# EAGLE design controller-left (EAGLE 8.6.0)
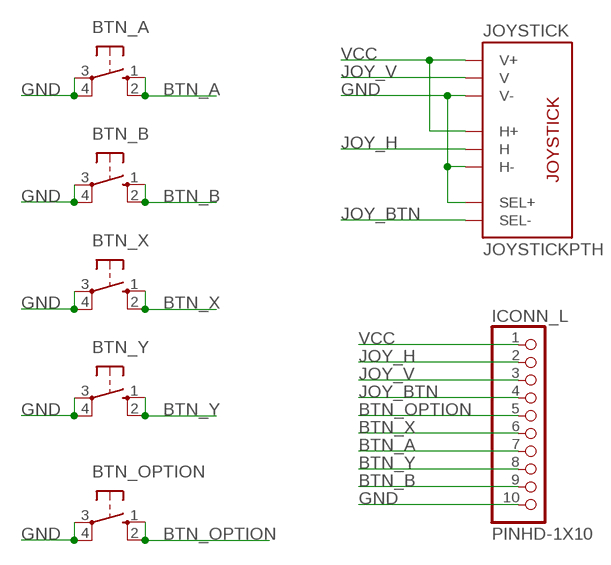
[diagram p0: schematic, sheet 1]

## Parts
BTN_A  40-XX-ROUND  [B3F-40XX-ROUND]
BTN_B  40-XX-ROUND  [B3F-40XX-ROUND]
BTN_OPTION  40-XX-ROUND  [B3F-40XX-ROUND]
BTN_X  40-XX-ROUND  [B3F-40XX-ROUND]
BTN_Y  40-XX-ROUND  [B3F-40XX-ROUND]
ICONN_L  PINHD-1X10  [1X10-BIG]
JOYSTICK  JOYSTICKPTH  [JOYSTICK]

## Nets
BTN_A: BTN_A.1(S) BTN_A.2(S1) ICONN_L.7
BTN_B: BTN_B.1(S) BTN_B.2(S1) ICONN_L.9
BTN_OPTION: BTN_OPTION.1(S) BTN_OPTION.2(S1) ICONN_L.5
BTN_X: BTN_X.1(S) BTN_X.2(S1) ICONN_L.6
BTN_Y: BTN_Y.1(S) BTN_Y.2(S1) ICONN_L.8
GND: BTN_A.3(P) BTN_A.4(P1) BTN_B.3(P) BTN_B.4(P1) BTN_OPTION.3(P) BTN_OPTION.4(P1) BTN_X.3(P) BTN_X.4(P1) BTN_Y.3(P) BTN_Y.4(P1) ICONN_L.10 JOYSTICK.B1A(SEL+) JOYSTICK.H3(H-) JOYSTICK.V3(V-)
JOY_BTN: ICONN_L.4 JOYSTICK.B2A(SEL-)
JOY_H: ICONN_L.2 JOYSTICK.H2(H)
JOY_V: ICONN_L.3 JOYSTICK.V2(V)
VCC: ICONN_L.1 JOYSTICK.H1(H+) JOYSTICK.V1(V+)

## Library data of the parts
BTN_A BTN_B BTN_OPTION BTN_X BTN_Y = adafruit:40-XX: OMRON SWITCH
ICONN_L = adafruit:PINHD-1X10: Pin header 1x10 0.1" spacing With round pins
JOYSTICK = adafruit:JOYSTICK: Thumb Joystick Joystick commonly found in PS2 controllers. Two pots and a select switch. Adapted from Sparkfun Library (but for more common 6mm switch sticks)

## Board
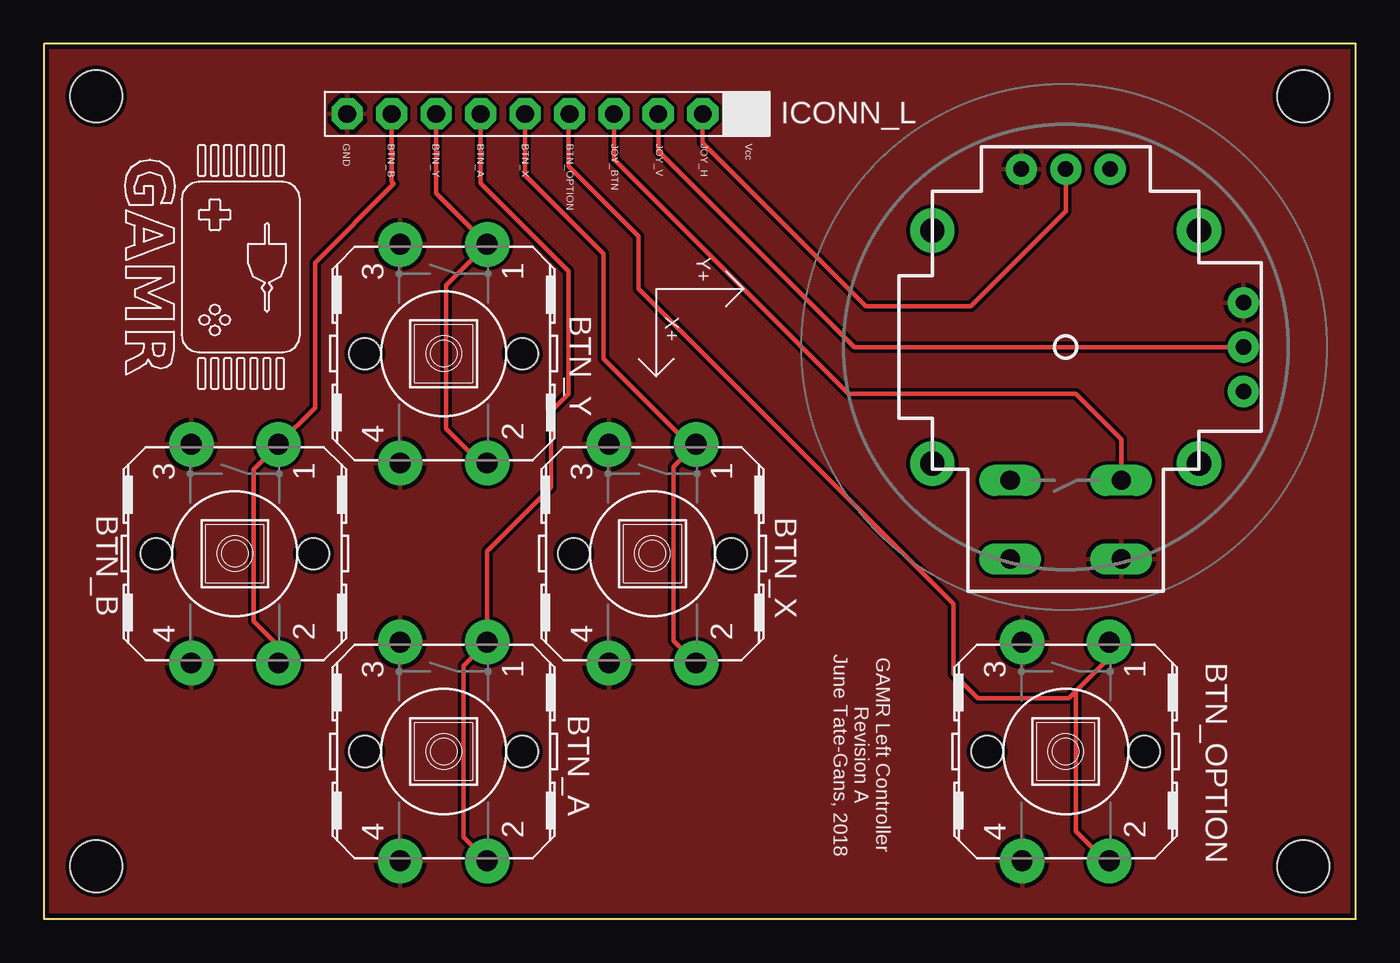
[diagram p1: board, top side]
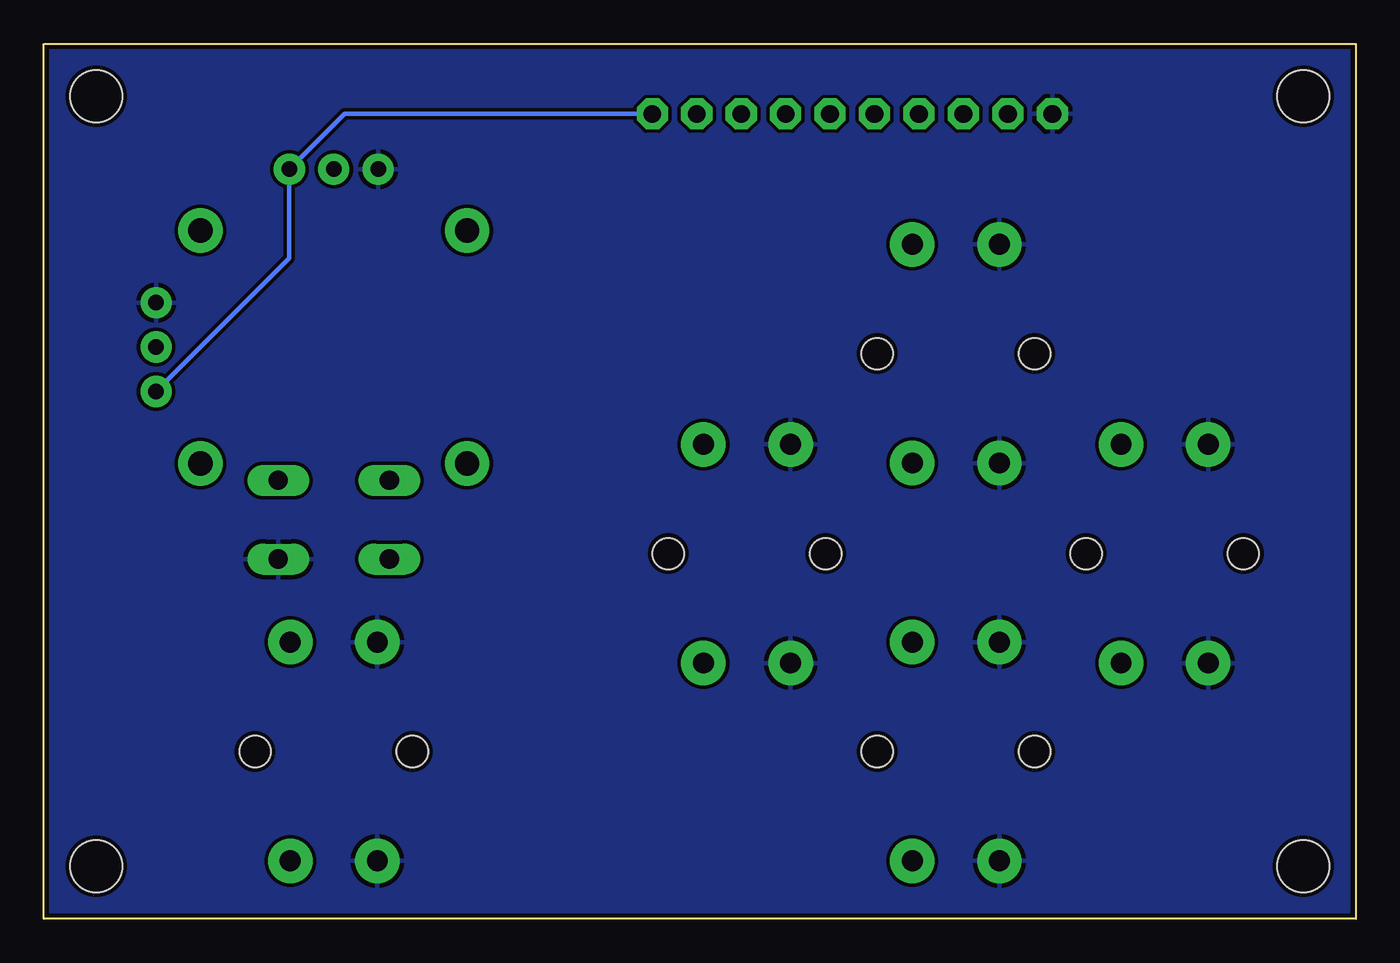
[diagram p2: board, bottom side, seen from below]

Size 75 x 50 mm. Coordinates in mm from the lower left corner, seen from the top.
Outline: 0,0 75,0 75,50 0,50 0,0
Copper layers (1*16): Top 0.035mm / dielectric 1.5mm / Bottom 0.035mm
Design rules "SparkFun": minimum track width 8mil, minimum drill 20mil, track to track 8mil, track to pad 8mil, pad to pad 8mil, via to via 8mil, smd to smd 8mil, copper to edge 10mil, drill to drill 8mil, minimum pad ring 12mil, minimum via ring 10mil, stop-mask expansion 4mil, vias tented up to drill 25mil, thermal gap 10mil
Holes 3 mm at 3,3 3,47 72,47 72,3

### Footprints (pad centres in the part's own frame; a part is rotated, then mirrored left to right if it is on the bottom)
B3F-40XX-ROUND = drill 1.194 pad 2.54: 1 -6.248,2.489; 2 6.248,2.489; 3 -6.248,-2.489; 4 6.248,-2.489 | hole 1.803: 0,-4.496; 0,4.496
1X10-BIG = drill 1.016 pad 1.778 octagon: 1 -11.43,0; 2 -8.89,0; 3 -6.35,0; 4 -3.81,0; 5 -1.27,0; 6 1.27,0; 7 3.81,0; 8 6.35,0; 9 8.89,0; 10 11.43,0
JOYSTICK = drill 1.1 pad 1.778 long: B1A -3.175,12.12; B1B 3.175,12.12; B2A -3.175,7.62; B2B 3.175,7.62 | drill 0.889 pad 1.778: H1 -2.54,-10.16; H2 0,-10.16; H3 2.54,-10.16; V1 -10.16,2.54; V2 -10.16,0; V3 -10.16,-2.54 | drill 1.397 pad 2.54: MOUNT1 -7.62,6.668; MOUNT2 -7.62,-6.668; MOUNT3 7.62,-6.668; MOUNT4 7.62,6.668

### Placement (x,y rotation side)
BTN_A  22.86,9.56 270 top
BTN_B  10.92,20.86 270 top
BTN_OPTION  58.42,9.56 270 top
BTN_X  34.8,20.86 270 top
BTN_Y  22.86,32.29 270 top
ICONN_L  28.78,45.99 180 top
JOYSTICK  58.42,32.67 180 top

### Tracks (layer width: path | path; a pad name or v marks a point on that pad's centre or on a via)
BTN_A
  Top 0.254: ICONN_L.7 24.97,42.03 30,37 30,30 29,29 29,24.65 25.35,21 BTN_A.1 24,14.46 24,4.66 BTN_A.2
BTN_B
  Top 0.254: BTN_B.2 13.41,15.59 12,17 12,25.7 BTN_B.1 15.5,29.2 15.5,37.5 20,42 19.89,42.11 ICONN_L.9
BTN_OPTION
  Top 0.254: 59,13 60.91,14.91 BTN_OPTION.1 60.91,16.09 | 59,13 59,5 60.69,3.31 BTN_OPTION.2 | ICONN_L.5 30,45.94 30,43 34,39 34,36 52,18 52,14 53.4,12.6 58.6,12.6 59,13
BTN_X
  Top 0.254: ICONN_L.6 27.51,42.49 32,38 32,32 37,27 37.29,27 BTN_X.1 36,25.82 36,15.9 BTN_X.2
BTN_Y
  Top 0.254: ICONN_L.8 22.43,41.46 BTN_Y.1 23,36.19 23,28 24.96,26.04 BTN_Y.2
GND
  pour Top (isolate 0.012): 0,50 0,0 75,0 75,50
  pour Bottom (isolate 0.012): 0,50 0,0 75,0 75,50
JOY_BTN
  Top 0.254: ICONN_L.4 32.59,43.41 46,30 59,30 61.59,27.41 JOYSTICK.B2A
JOY_H
  Top 0.254: ICONN_L.2 37.67,44.33 47,35 53,35 58.42,40.42 JOYSTICK.H2
JOY_V
  Top 0.254: ICONN_L.3 35.13,43.87 46.33,32.67 JOYSTICK.V2
VCC
  Bottom 0.254: ICONN_L.1 57.8,45.99 JOYSTICK.H1 60.96,37.75 JOYSTICK.V1

### Text on the board
tPlace: GND | BTN_B | BTN_Y | BTN_A | BTN_X | BTN_OPTION | JOY_BTN | JOY_V | JOY_H | Vcc | Y+ | X+ | GAMR Left Controller / Revision A / June Tate-Gans, 2018 | /home/jtgans/Pictures/By Me/gamr-flat.bmp